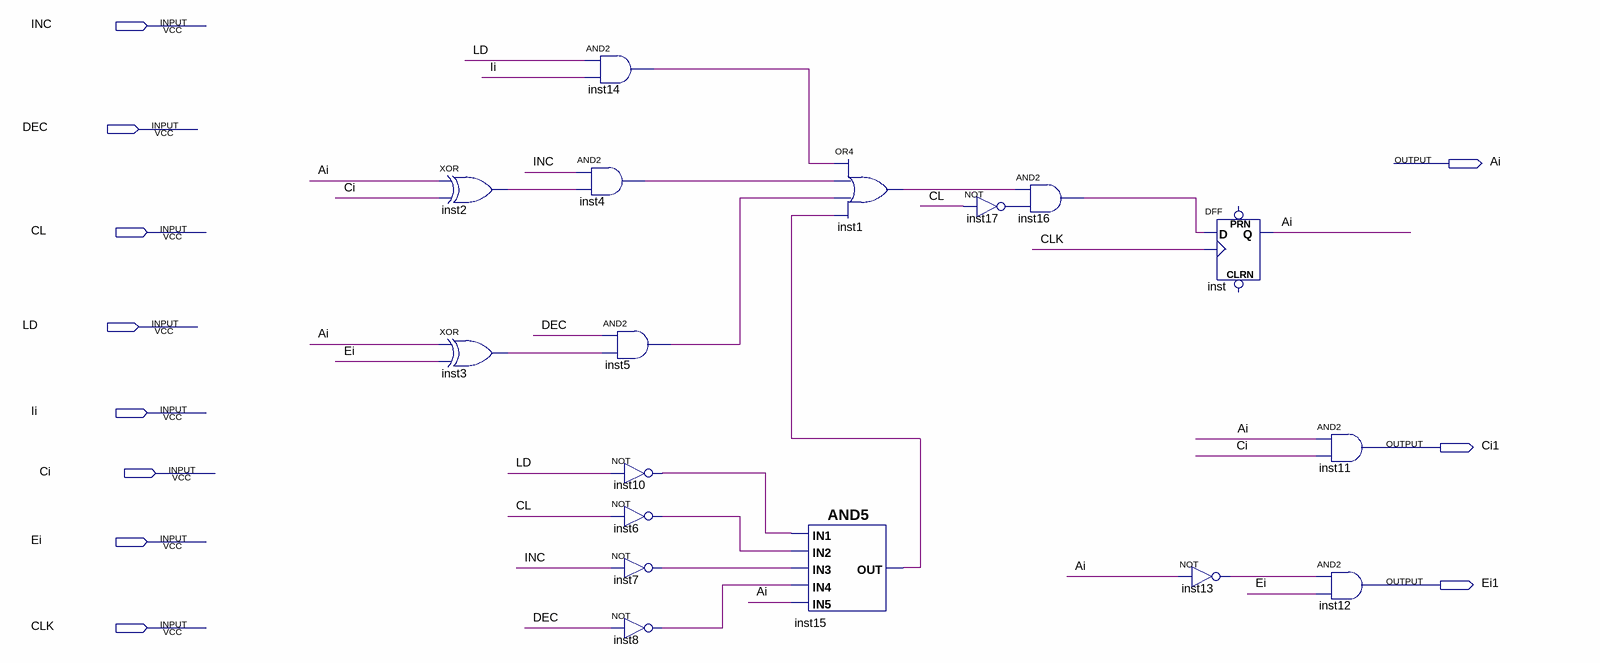
[diagram p0: schematic sheet]
// Quartus schematic REG1_LD_CL_INC_DEC.bdf as structural Verilog: 17 symbols, 11 pins
module REG1_LD_CL_INC_DEC (
  input  INC,
  input  DEC,
  input  CL,
  input  LD,
  input  Ii,
  input  Ci,
  input  Ei,
  input  CLK,
  output Ai,
  output Ci1,
  output Ei1
);

  wire inst1_out, inst2_out, inst3_out, inst4_out, inst5_out, inst6_out, inst7_out, inst8_out, inst10_out,
       inst13_out, inst14_out, inst15_out, inst16_out, inst17_out;

  xor inst2 (inst2_out, Ai, Ci);
  xor inst3 (inst3_out, Ai, Ei);
  and inst14 (inst14_out, LD, Ii);
  and inst4 (inst4_out, INC, inst2_out);
  and inst5 (inst5_out, DEC, inst3_out);
  not inst10 (inst10_out, LD);
  not inst6 (inst6_out, CL);
  not inst7 (inst7_out, INC);
  not inst8 (inst8_out, DEC);
  and inst15 (inst15_out, inst10_out, inst6_out, inst7_out, inst8_out, Ai);
  or inst1 (inst1_out, inst14_out, inst4_out, inst5_out, inst15_out);
  and inst16 (inst16_out, inst1_out, inst17_out);
  not inst17 (inst17_out, CL);
  DFF inst (.CLK(CLK), .D(inst16_out), .Q(Ai));  // open: CLRN, PRN
  not inst13 (inst13_out, Ai);
  and inst11 (Ci1, Ai, Ci);
  and inst12 (Ei1, inst13_out, Ei);
endmodule
